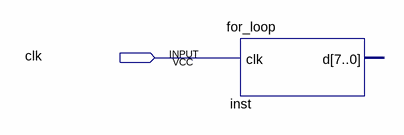
[diagram p0: schematic sheet]
// Quartus schematic f_b.bdf as structural Verilog: 1 symbols, 1 pins
module f_b (
  input  clk
);

  for_loop inst (.clk(clk));  // open: d
endmodule
